# EAGLE design tweeq_stamp_9DOF (EAGLE 6.4)
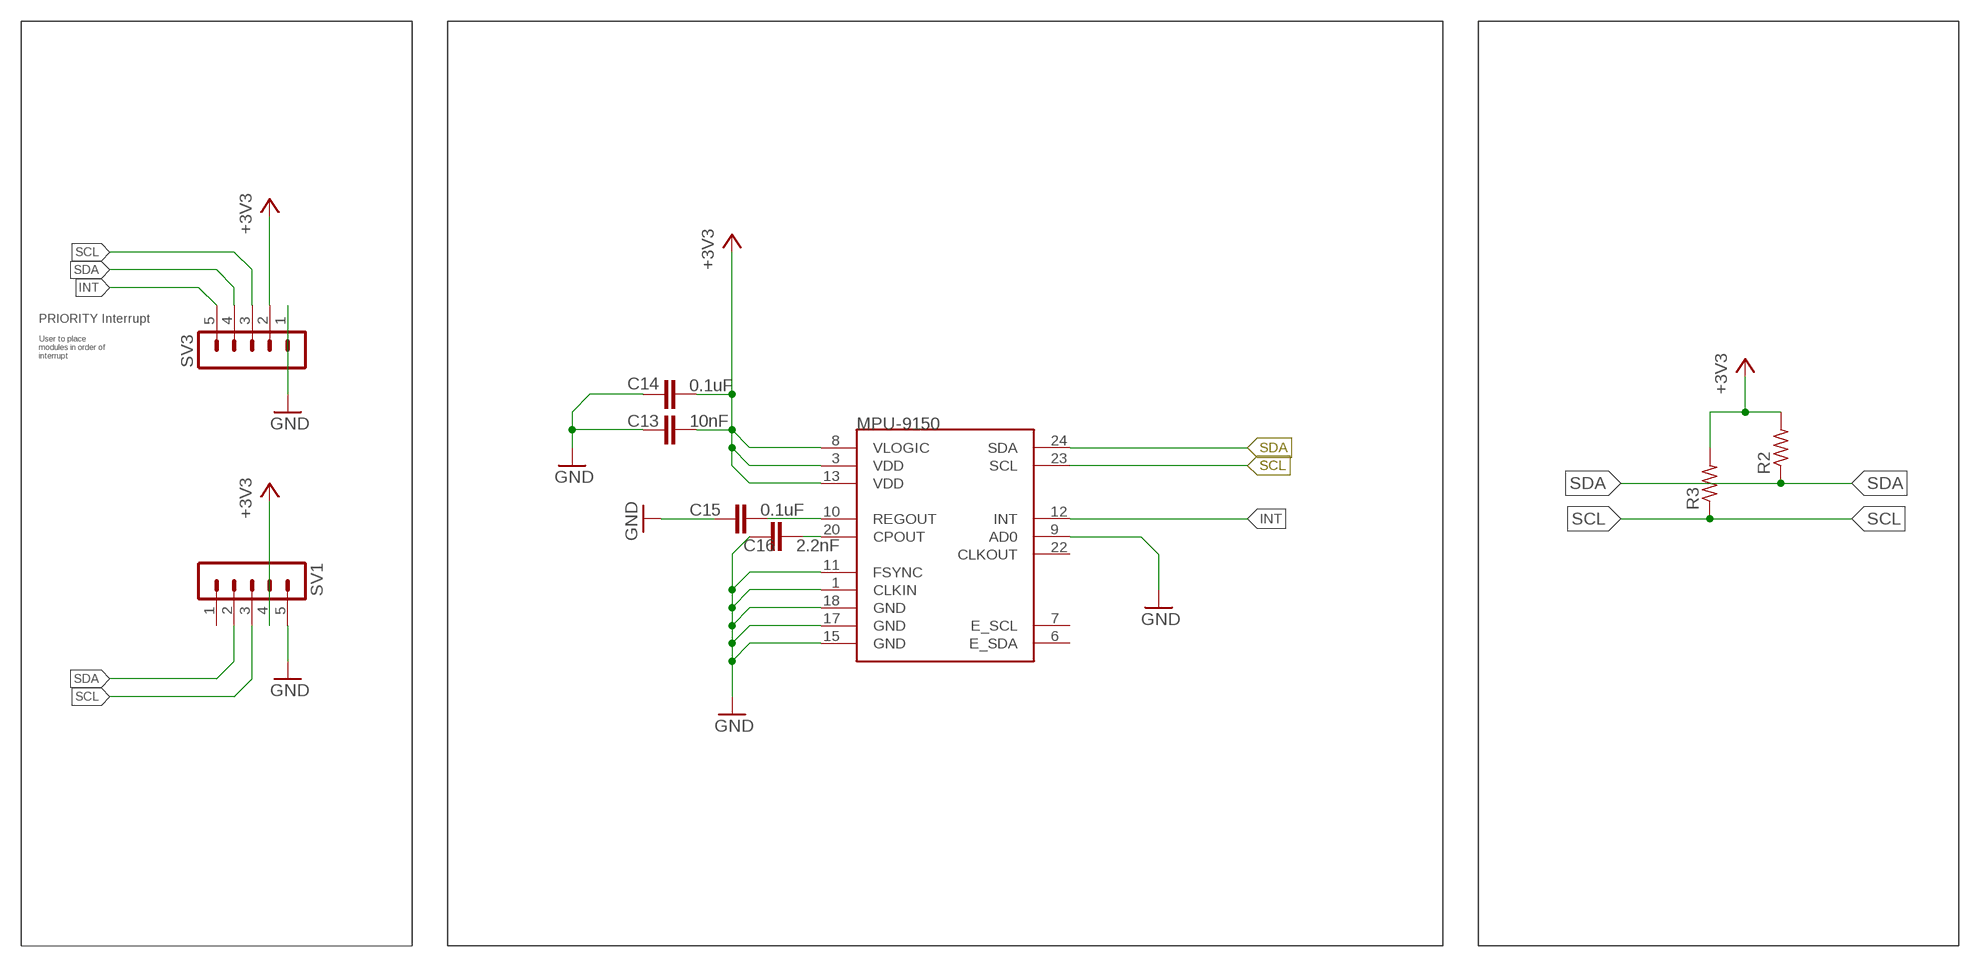
[diagram p0: schematic, sheet 1]

## Parts
C13  10nF  C-EUC0402K  [C0402K]
C14  0.1uF  C-EUC0402K  [C0402K]
C15  0.1uF  C-EUC0402K  [C0402K]
C16  2.2nF  C-EUC0402K  [C0402K]
MPU-9150  MPU-9150QFN-24-NP  [QFN-24-NP]
R2  R-US_R0402  [R0402]
R3  R-US_R0402  [R0402]
SV1  M05-1STAMP  [1X05-1.5MM-STAMP]
SV3  M05-1STAMP  [1X05-1.5MM-STAMP]

## Nets
+3V3: C13.2 C14.2 MPU-9150.3(VDD) MPU-9150.8(VLOGIC) MPU-9150.13(VDD) R2.2 R3.2 SV1.4 SV3.2
GND: C13.1 C14.1 C15.1 C16.1 MPU-9150.1(CLKIN) MPU-9150.9(AD0) MPU-9150.11(FSYNC) MPU-9150.15(GND) MPU-9150.17(GND) MPU-9150.18(GND) SV1.5 SV3.1
INT: MPU-9150.12(INT) SV3.5
N$11: C16.2 MPU-9150.20(CPOUT)
N$17: C15.2 MPU-9150.10(REGOUT)
SCL: MPU-9150.23(SCL) R3.1 SV1.3 SV3.3
SDA: MPU-9150.24(SDA) R2.1 SV1.2 SV3.4
Unconnected: MPU-9150.6(E_SDA) MPU-9150.7(E_SCL) MPU-9150.22(CLKOUT) SV1.1

## Notes on the sheet
- 9DOF IMU - MPU-9150
- PRIORITY Interrupt
- User to place 
  modules in order of 
  interrupt

## Library data of the parts
C13-C16 = AISCube:C-EU: CAPACITOR, European symbol
MPU-9150 = SparkFun-Sensors:MPU-9150: 9DOF (3mag, 3accel, 3rotat). I2C interface.
R2 R3 = AISCube:R-US_: RESISTOR, American symbol
SV1 SV3 = AISCube:M05-1: PIN HEADER Standard 0.1" header pin 5 pins - 1 way

## Board
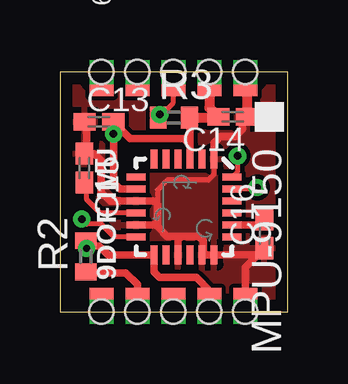
[diagram p1: board, top side]
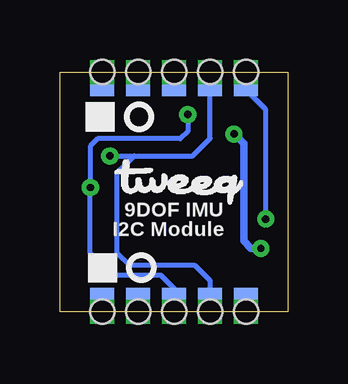
[diagram p2: board, bottom side, seen from below]

Size 9.5 x 10 mm. Coordinates in mm from the lower left corner, seen from the top.
Outline: 9.5,10 0,10 0,0 9.5,0 9.5,10
Copper layers (1*16): Top 0.0356mm / dielectric 1.5011mm / Bottom 0.0356mm
Design rules "AISCube": minimum track width 7mil, minimum drill 14mil, track to track 7mil, track to pad 7mil, pad to pad 7mil, via to via 7mil, smd to smd 0mil, copper to edge 20mil, drill to drill 8mil, minimum pad ring 10mil, minimum via ring 8mil, stop-mask expansion 4mil, vias tented up to drill 32mil, thermal gap 10mil

### Footprints (pad centres in the part's own frame; a part is rotated, then mirrored left to right if it is on the bottom)
C0402K = smd 0.925 x 0.74: 1 -0.6,0; 2 0.6,0
QFN-24-NP = smd 0.8 x 0.3: 1 -2,1.25; 2 -2,0.75; 3 -2,0.25; 4 -2,-0.25; 5 -2,-0.75; 6 -2,-1.25; 13 2,-1.25; 14 2,-0.75; 15 2,-0.25; 16 2,0.25; 17 2,0.75; 18 2,1.25 | smd 0.3 x 0.8: 7 -1.25,-2; 8 -0.75,-2; 9 -0.25,-2; 10 0.25,-2; 11 0.75,-2; 12 1.25,-2; 19 1.25,2; 20 0.75,2; 21 0.25,2; 22 -0.25,2; 23 -0.75,2; 24 -1.25,2
R0402 = smd 0.7 x 0.9: 1 -0.65,0; 2 0.65,0
1X05-1.5MM-STAMP = drill 0.5 pad 1 square: 1 -3,0; 2 -1.5,0; 3 0,0; 4 1.5,0; 5 3,0 | smd 1 x 0.6: P$1 -3,0.7; P$2 -1.5,0.7; P$3 0,0.7; P$4 1.5,0.7; P$5 3,0.7 | smd 1 x 0.6 bottom: P$6 -3,0.7; P$7 -1.5,0.7; P$8 0,0.7; P$9 1.5,0.7; P$10 3,0.7 | hole 1: -3,0; -1.5,0; 0,0; 1.5,0; 3,0

### Placement (x,y rotation side)
C13  1.63,7.92 0 top
C14  7.21,8.13 180 top
C15  1.02,5.99 270 top
C16  8.53,3.25 90 top
MPU-9150  5.18,4.37 270 top
R2  1.09,2.31 90 top
R3  4.75,8.1 0 top
SV1  4.74,0 0 top
SV3  4.74,10 180 top
U$1  [TWEEQ-LOGO-S]  7.21,4.47 0 bottom

### Tracks (layer width: path | path; a pad name or v marks a point on that pad's centre or on a via)
+3V3  (via drill 0.3)
  Top 0.305: MPU-9150.8 2.5,5.12 2.23,5.38 v2.23,7.42 C13.2 2.94,7.21 5.18,7.21 5.43,6.96 MPU-9150.3 5.43,7.97 R3.2 | R2.2 1.09,2.67 v1.12,2.64 1.22,2.74 1.63,2.74 2,2.37 MPU-9150.13 3.93,1.66 4.17,1.42 5.69,1.42 6.24,0.88 SV1.4
  Top 0.406: R3.2 6.48,8.1 C14.2 6.24,8.51 SV3.2
  Bottom 0.305: v1.12,2.64 1.52,2.64 1.83,2.95 1.83,7.01 v2.23,7.42
GND
  Top 0.203: MPU-9150.1 6.43,5.72 6.2,5.49 4.47,5.49 4.06,5.08 4.06,3.76
  Top 0.305: MPU-9150.15 4.93,3 5.08,3.15 | 5.08,3.15 5.79,3.15 5.99,2.95 5.99,2.43 MPU-9150.17 MPU-9150.18 8.25,2.37 C16.1 7.74,1.85 SV1.5 | MPU-9150.11 3.92,3.62 4.06,3.76 | 4.06,3.76 4.06,4.47 3.92,4.62 MPU-9150.9 2.09,4.62 1.73,4.98 1.73,6.3 1.43,6.59 C15.1 1.12,6.7 1.12,7.92 C13.1 | C14.1 7.62,7.93 7.62,7.62 7.32,7.32 6.71,7.32 6.43,7.04 MPU-9150.1 | 4.06,3.76 4.06,3.56 4.47,3.15 5.08,3.15
  Top 0.406: C14.1 7.81,9.92 SV3.1
  pour Bottom: 0.09,9.85 9.34,9.85 9.34,0.11 0.09,0.11
  pour Top: 0.1,9.86 9.35,9.86 9.35,0.1 0.1,0.1
INT  (via drill 0.3)
  Top 0.203: MPU-9150.12 2.27,3.12 1.73,3.66 1.12,3.66 v0.91,3.86
  Bottom 0.203: v0.91,3.86 0.91,8.43 1.73,9.25 1.73,9.99 SV3.5
N$11
  Top 0.305: MPU-9150.20 8.3,3.62 C16.2
N$17
  Top 0.203: MPU-9150.10 1.67,4.12 1.12,4.67 1.12,5.29 C15.2
SCL  (via drill 0.3)
  Top 0.203: v4.17,8.23 4.1,8.17 R3.1 4.74,8.73 SV3.3 | v8.23,5.18 8.17,5.12 MPU-9150.23
  Bottom 0.203: v4.17,8.23 4.17,7.52 4.47,7.21 7.92,7.21 8.23,6.91 v8.23,5.18 8.23,2.44 7.32,1.52 5.28,1.52 4.74,0.98 SV1.3
SDA  (via drill 0.3)
  Top 0.203: MPU-9150.24 7.42,5.85 v7.42,6.5
  Top 0.305: R2.1 1.22,1.63 2.74,1.63 3.23,1.13 SV1.2
  Bottom 0.203: v7.42,6.5 6.4,6.5 | 6.4,6.5 3.96,6.5 3.23,7.23 SV3.4 | 6.4,6.5 7.11,5.79 7.11,2.44 6.6,1.93 3.86,1.93 3.23,1.3 SV1.2

### Text on the board
tPlace: 9DOF IMU
bPlace: 9DOF IMU | I2C Module
tNames: 6V-9V DC | ON
bNames: Breadboard | V-Reg | Module